# Altium schematic sheet Capteurs.SchDoc
size A4; SheetNumber: 2; SheetTotal: 7
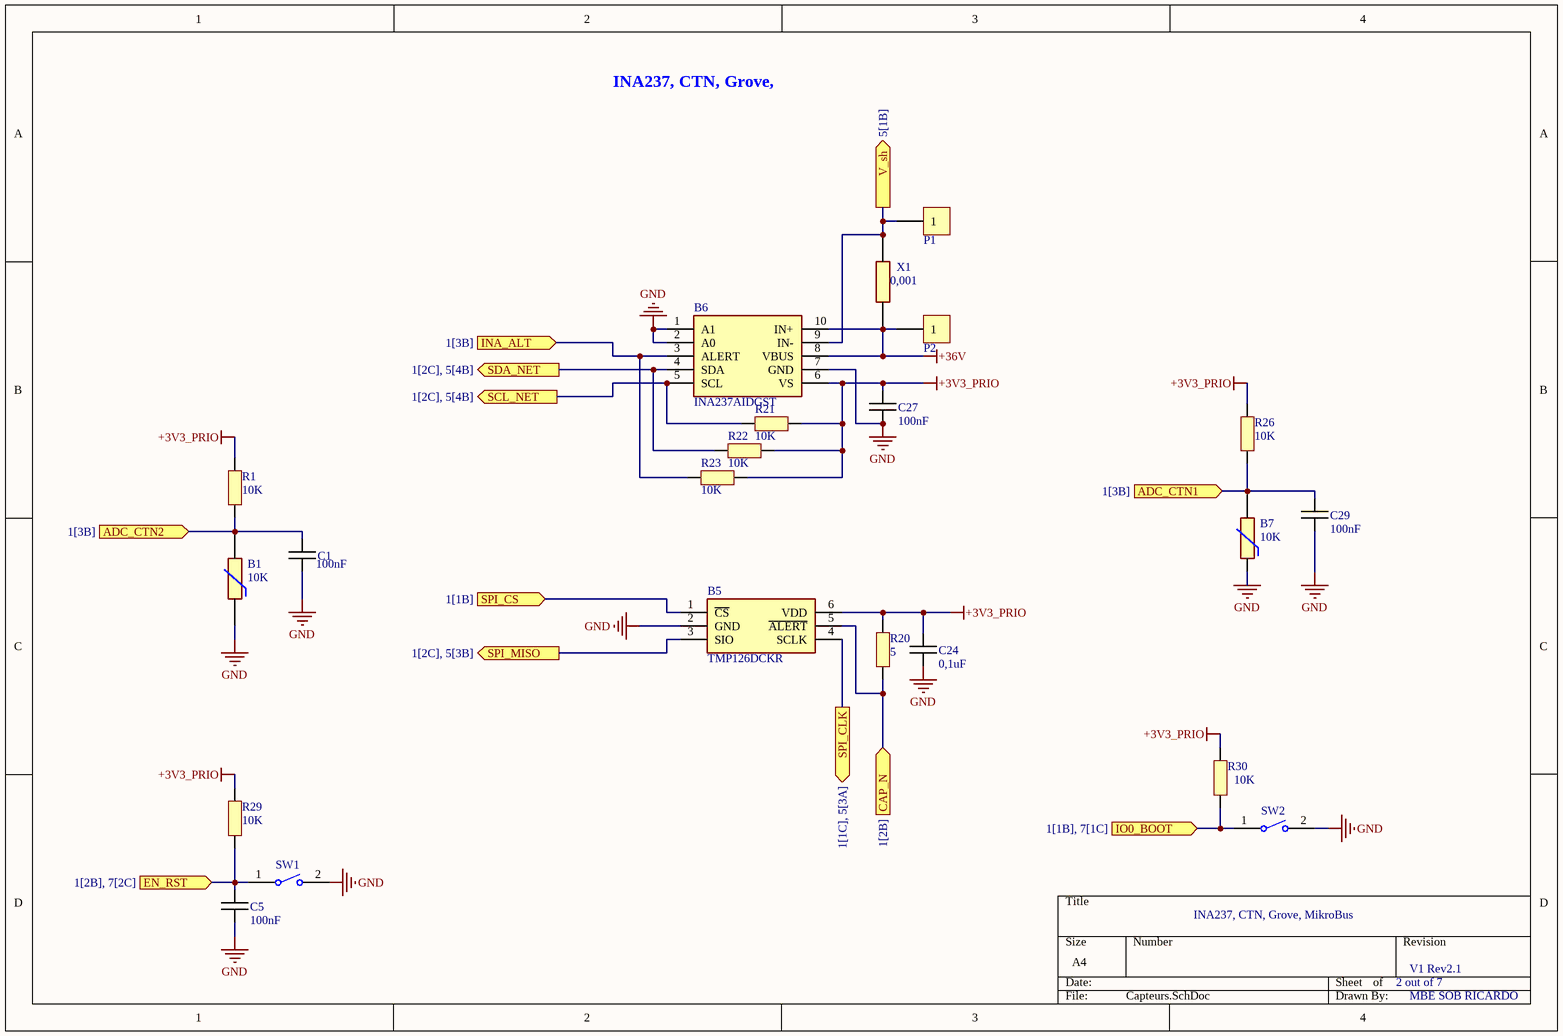
[diagram p0: Capteurs.SchDoc]

## Parts
B1  10K  [RESC2212X50N]
B5  TMP126DCKR  [SOT65P210X110-6N]
B6  INA237AIDGST  [SOP50P490X110-10N]
B7  10K  [RESC2212X50N]
C1  100nF  [CAPC1005X06N]
C5  100nF  [CAPC1005X06N]
C24  0,1uF  [CAPC1005X06N]
C27  100nF  [CAPC1005X06N]
C29  100nF  [CAPC1005X06N]
P1  Plage CMS 10x5  [Plage CMS 10x5]  (value not drawn)  (no BOM)
P2  Plage CMS 10x5  [Plage CMS 10x5]  (value not drawn)  (no BOM)
R1  10K  [RESC1005X06N]
R20  5  [RESC1005X06N]
R21  10K  [RESC1005X06N]
R22  10K  [RESC1005X06N]
R23  10K  [RESC1005X06N]
R26  10K  [RESC1005X06N]
R29  10K  [RESC1005X06N]
R30  10K  [RESC1005X06N]
SW1  FSMSM  [TECO-FSMSM-2_V]  (value not drawn)
SW2  FSMSM  [TECO-FSMSM-2_V]  (value not drawn)
X1  0,001  [RESC10052X200N]

## Ports
ADC_CTN1 (in, see 1[3B]), ADC_CTN2 (in, see 1[3B]), CAP_N (in, see 1[2B]), EN_RST (in, see 1[2B], 7[2C]), INA_ALT (in, see 1[3B]), IO0_BOOT (in, see 1[1B], 7[1C]), SCL_NET (out, see 1[2C], 5[4B]), SDA_NET (out, see 1[2C], 5[4B]), SPI_CLK (out, see 1[1C], 5[3A]), SPI_CS (in, see 1[1B]), SPI_MISO (out, see 1[2C], 5[3B]), V_sh (out, see 5[1B])

## Nets
+3V3_PRIO: B5.6(VDD) B6.6(VS) C24.1 C27.2 R1.2 R20.2 R21.1 R22.1 R23.1 R26.2 R29.1 R30.1
+36V: B6.8(VBUS) B6.10(IN+) P2.1 X1.1
GND: B1.1 B5.2(GND) B6.1(A1) B6.2(A0) B6.7(GND) B7.1 C1.2 C5.1 C24.2 C27.1 C29.1 SW1.2 SW2.2
ADC_CTN1: B7.2 C29.2 R26.1 ; port ADC_CTN1
ADC_CTN2: B1.2 C1.1 R1.1 ; port ADC_CTN2
CAP_N: B5.5(~{ALERT}) R20.1 ; port CAP_N
EN_RST: C5.2 R29.2 SW1.1 ; port EN_RST
INA_ALT: B6.3(ALERT) R23.2 ; port INA_ALT
IO0_BOOT: R30.2 SW2.1 ; port IO0_BOOT
SCL_NET: B6.5(SCL) R21.2 ; port SCL_NET
SDA_NET: B6.4(SDA) R22.2 ; port SDA_NET
SPI_CLK: B5.4(SCLK) ; port SPI_CLK
SPI_CS: B5.1(~{CS}) ; port SPI_CS
SPI_MISO: B5.3(SIO) ; port SPI_MISO
V_sh: B6.9(IN-) P1.1 X1.2 ; port V_sh

## Notes on the sheet
- INA237, CTN, Grove, MikroBus
- 2 out of 7
- V1 Rev2.1
- MBE SOB RICARDO

## Library data of the parts
B1 B7 = NB12K00103JBB: NTC SMD Thermistor, NB12K, 10K, 5% AVX 10k 0805 Protection NTC Thermistor, 5s, 2 x 1.25 x 1.3mm; Manufacturer_Name: Kyocera AVX; Geometry.Height: 0.5mm; Manufacturer_Part_Number: NB12K00103JBB; Mouser Part Number: 581-NB12K00103JBB; Mouser Price/Stock: https://www.mouser.co.uk/ProductDetail/AVX/NB12K00103JBB/?qs=4%252B6%252BTdINQeDPvI%252BQUQjJ3Q%3D%3D; Arrow Part Number: NB12K00103JBB; Arrow Price/Stock: https://www.arrow.com/en/products/nb12k00103jbb/avx; Datasheet Link: https://datasheet.datasheetarchive.com/originals/distributors/Datasheets-DGA6/551314.pdf
B5 = TMP126DCKR: Board Mount Temperature Sensors +/-0.25 C SPI temperature sensor with 175 C operation, CRC and slew-rate alert; Manufacturer_Name: Texas Instruments; Manufacturer_Part_Number: TMP126DCKR; Mouser Part Number: 595-TMP126DCKR
B6 = INA237AIDGST: Current Sense Amplifiers 85-V, 16-bit, I2C output current/voltage/power monitor with alert 10-VSSOP -40 to 125; Manufacturer_Name: Texas Instruments; Manufacturer_Part_Number: INA237AIDGST; Mouser Part Number: 595-INA237AIDGST
C1 C5 C24 C27 C29 = Capacitor
P1 P2 = Plage CMS 10x5: Plage de report CMS 10x5mm; PN: L30; Value: Plage CMS 10x5; Footprint_statut: ok
R1 R20-R23 R26 R29 R30 = Resistor
SW1 SW2 = CMP-2000-07511-1: FSMSM Push Button Switch, 50 mA, -35 to 85 degC, 2-Pin SMD, RoHS, Bulk; Manufacturer: TE Connectivity; Actuator Length: 1.07mm; Electrical Life: 20000Cycles; Actuator Material: Polyamide; Current Rating: 50mA; Illumination Type: Illuminated; Voltage Rating (DC): 24V; Contact Resistance: 100mOhm; Case\/Package: SMD/SMT; Operating Force: 180gf; Switch Travel: 0.25mm; Max Voltage Rating (DC): 12V; Throw Configuration: SPST; Packaging: LoosePiece; Max Operating Temperature: 85degC; ELV: Compliant; Package Description: 2-Pin Surface Mount Device, Body 6 x 3.5 mm, Pitch 9.19 mm; RoHSCompliant: true; Manufacturer URL: http://www.te.com/; Contact Plating: Silver; Contact Material: Brass; Mounting Technology: SurfaceMount; Contact Current Rating: 50mA; Datasheet Version: Rev. C2, 08/2014; Datasheet URL: http://www.te.com/commerce/DocumentDelivery/DDEController?Action=showdoc&DocId=Customer+Drawing%7F1437566-3%7FC2%7Fpdf%7FEnglish%7FENG_CD_1437566-3_C2_1437566_3_1_c.dwg.pdf%7F1437566-3; Mechanical Life: 20000Cycles; Package Reference: FSMSM; REACH SVHC: Unknown; Orientation: Straight; Min Operating Temperature: -35degC; Lead Free: LeadFree; Termination: GullWing; Package Quantity: 1000; Mount: SurfaceMount
X1 = PSR400ITQFF0L50: ROHM - PSR400ITQFF0L50 - SMD Current Sense Resistor, 500 ohm, PSR Series, 3921 [1052 Metric], 4 W, +/- 1%, Metal Strip; Manufacturer_Name: ROHM Semiconductor; Geometry.Height: 2mm; Manufacturer_Part_Number: PSR400ITQFF0L50; Mouser Part Number: 755-PSR400ITQFF0L50; Mouser Price/Stock: https://www.mouser.co.uk/ProductDetail/ROHM-Semiconductor/PSR400ITQFF0L50?qs=493kPxzlxfLaT1w5Mo%252BtHg%3D%3D; Arrow Part Number: *; Arrow Price/Stock: *; Datasheet Link: https://componentsearchengine.com/Datasheets/2/PSR400ITQFF0L50.pdf